# EAGLE design teensy_ms (EAGLE 9.6.2)
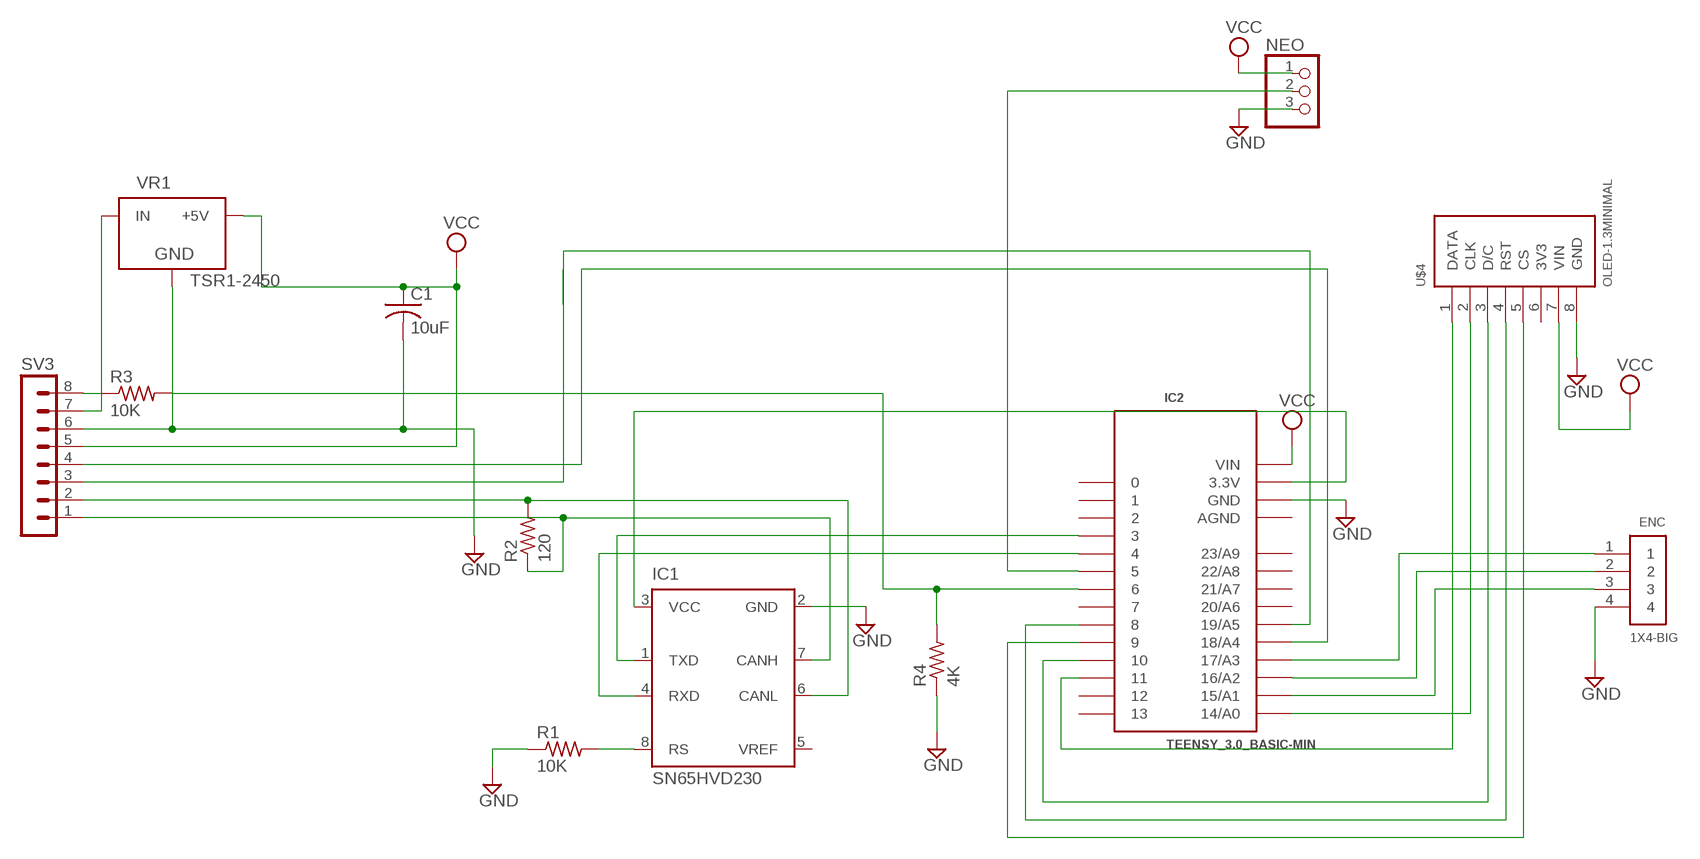
[diagram p0: schematic, sheet 1]

## Parts
C1  10uF  C-USC1206  [C1206]
ENC  1X4-BIG  [1X04-BIG]
IC1  SN65HVD230  [SO8]
IC2  TEENSY_3.0_BASIC-MIN  [TEESNY_3.0_BASIC-MIN]
NEO  PINHD-1X3  [1X03]
R1  10K  R-US_M1206  [M1206]
R2  120  R-US_M1206  [M1206]
R3  10K  R-US_M1206  [M1206]
R4  4K  R-US_M1206  [M1206]
SV3  MA08-1  [MA08-1]
U$4  OLED-1.3MINIMAL  [OLED-1.3-BARE]
VR1  TSR1-2450  [TSR-1]

## Nets
GND: C1.2 ENC.4 IC1.2(GND) IC2.GND NEO.3 R1.1 R4.1 SV3.6 U$4.8(GND) VR1.2(GND)
N$1: IC1.8(RS) R1.2
N$2: IC1.3(VCC) IC2.3.3V
N$3: SV3.7 VR1.1(IN)
N$8: IC2.11 U$4.1(DATA)
N$9: IC2.14/A0 U$4.2(CLK)
N$10: IC2.10 U$4.3(D/C)
N$11: IC2.8 U$4.4(RST)
N$12: IC2.9 U$4.5(CS)
N$13: IC1.4(RXD) IC2.4
N$14: IC2.19/A5 SV3.3
N$15: IC1.1(TXD) IC2.3
N$16: IC2.18/A4 SV3.4
N$17: IC2.5 NEO.2
N$18: IC1.7(CANH) R2.1 SV3.1
N$19: IC2.6 R3.2 R4.2
N$20: IC1.6(CANL) R2.2 SV3.2
N$21: ENC.3 IC2.15/A1
N$22: ENC.2 IC2.16/A2
N$23: ENC.1 IC2.17/A3
N$24: R3.1 SV3.8
VCC: C1.1 IC2.VIN NEO.1 SV3.5 U$4.7(VIN) VR1.3(+5V)
Unconnected: IC1.5(VREF) IC2.0 IC2.1 IC2.2 IC2.7 IC2.12 IC2.13 IC2.20/A6 IC2.21/A7 IC2.22/A8 IC2.23/A9 U$4.6(3V3)

## Power pins joined to a net without a drawn wire
AGND: IC2.AGND

## Library data of the parts
C1 = rcl:C-US: CAPACITOR, American symbol
ENC = adafruit:1X4: 4-pin connector
IC1 = open-bldc:SN65HVD230: SN65HVD230 - 3.3V CAN Transceiver - 3.3V operation - ISO 11898 compliant - up to 1Mbps - up to 120 nodes - listen only mode - slope control
IC2 = Teensy3.0-custom:TEENSY_3.0_BASIC-MIN
NEO = adafruit:PINHD-1X3: PIN HEADER
R1-R4 = adafruit:R-US_: RESISTOR, American symbol
SV3 = con-lstb:MA08-1: PIN HEADER; OC_FARNELL: unknown; OC_NEWARK: unknown
U$4 = custom:OLED-1.3
VR1 = SteelCaveRobotics-Power:TSR1-2450: Traco Power TSR 1-2450 5.0v switching regulator

## Board
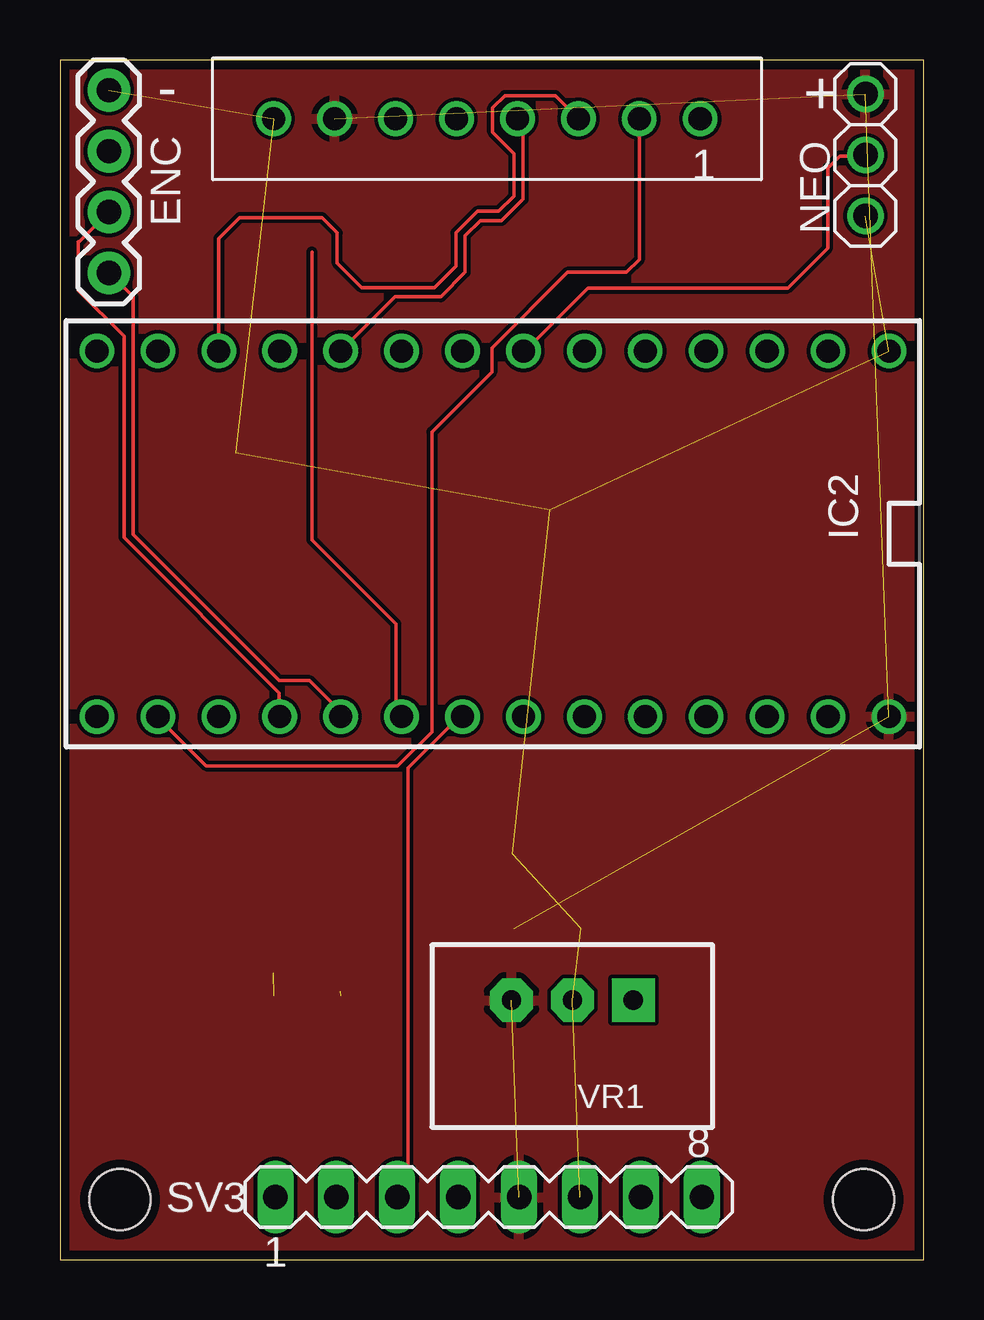
[diagram p1: board, top side]
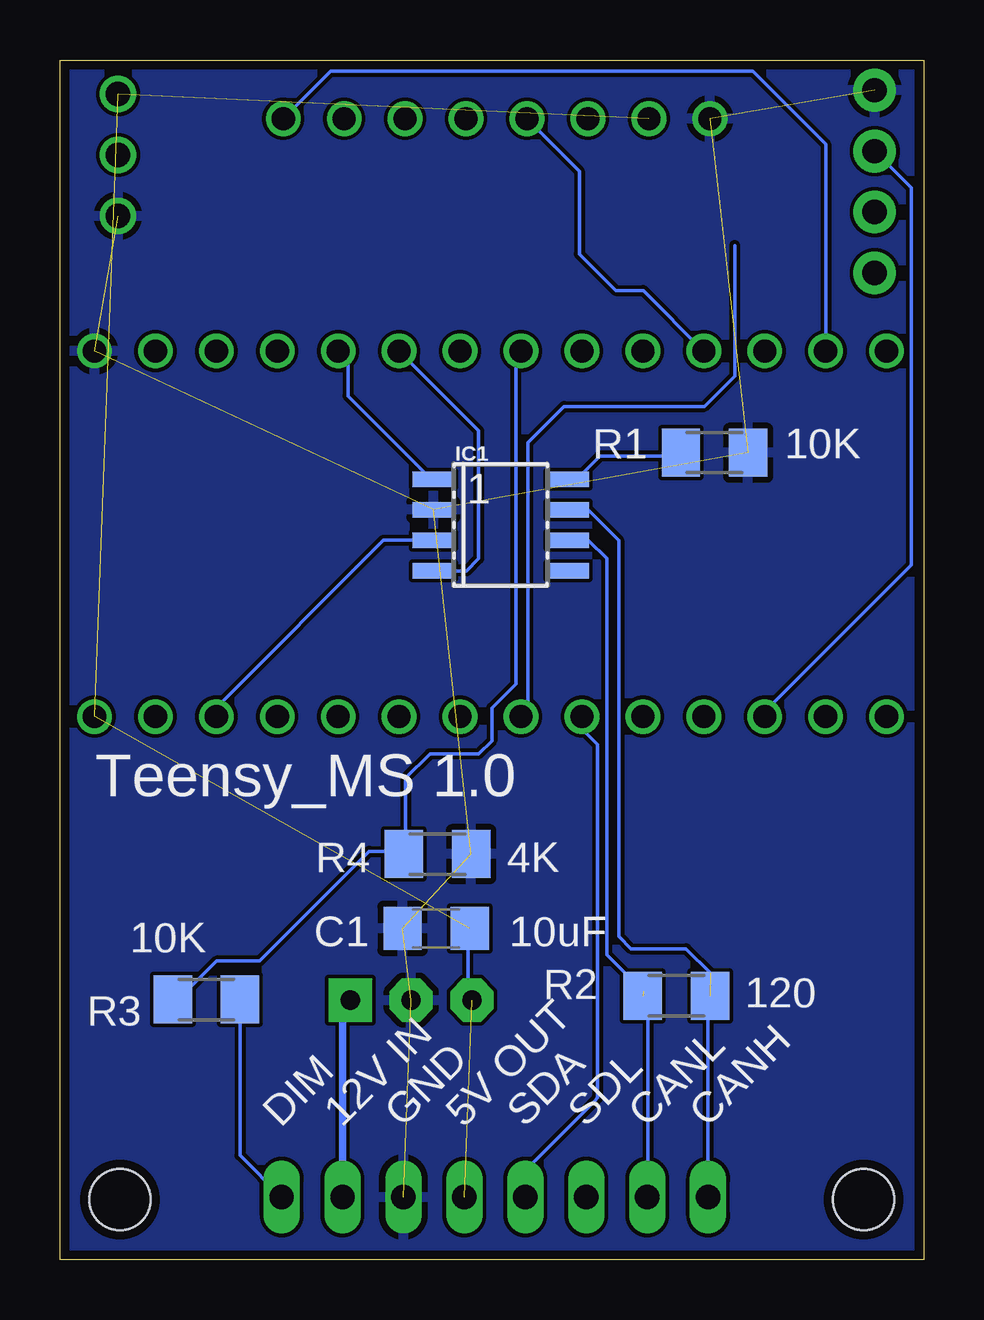
[diagram p2: board, bottom side, seen from below]

Size 36 x 50 mm. Coordinates in mm from the lower left corner, seen from the top.
Outline: 0,0 36,0 36,50 0,50 0,0
Copper layers (1*16): Top 0.0356mm / dielectric 1.5011mm / Bottom 0.0356mm
Design rules "oshpark-2layer": minimum track width 6mil, minimum drill 13mil, track to track 6mil, track to pad 6mil, pad to pad 6mil, via to via 6mil, smd to smd 6mil, copper to edge 15mil, drill to drill 6mil, minimum pad ring 7mil, minimum via ring 7mil, stop-mask expansion 4mil, vias tented up to drill 0mil, thermal gap 10mil
Holes 2.54 mm at 2.5,2.5 33.5,2.5

### Footprints (pad centres in the part's own frame; a part is rotated, then mirrored left to right if it is on the bottom)
C1206 = smd 1.6 x 1.8: 1 -1.4,0; 2 1.4,0
1X04-BIG = drill 1.016 pad 1.778: 1 0,0; 2 2.54,0; 3 5.08,0; 4 7.62,0
SO8 = smd 0.65 x 1.75: 1 -1.905,-2.8; 2 -0.635,-2.8; 3 0.635,-2.8; 4 1.905,-2.8; 5 1.905,2.8; 6 0.635,2.8; 7 -0.635,2.8; 8 -1.905,2.8
TEESNY_3.0_BASIC-MIN = drill 0.965: 0 -7.62,15.24; 1 -7.62,12.7; 2 -7.62,10.16; 3 -7.62,7.62; 3.3V 7.62,12.7; 4 -7.62,5.08; 5 -7.62,2.54; 6 -7.62,0; 7 -7.62,-2.54; 8 -7.62,-5.08; 9 -7.62,-7.62; 10 -7.62,-10.16; 11 -7.62,-12.7; 12 -7.62,-15.24; 13 7.62,-15.24; 14/A0 7.62,-12.7; 15/A1 7.62,-10.16; 16/A2 7.62,-7.62; 17/A3 7.62,-5.08; 18/A4 7.62,-2.54; 19/A5 7.62,0; 20/A6 7.62,2.54; 21/A7 7.62,5.08; 22/A8 7.62,7.62; 23/A9 7.62,10.16; AGND 7.62,15.24; GND -7.62,17.78; VIN 7.62,17.78
1X03 = drill 1.016: 1 -2.54,0; 2 0,0; 3 2.54,0
M1206 = smd 1.6 x 2: 1 -1.4,0; 2 1.4,0
MA08-1 = drill 1.016 long: 1 -8.89,0; 2 -6.35,0; 3 -3.81,0; 4 -1.27,0; 5 1.27,0; 6 3.81,0; 7 6.35,0; 8 8.89,0
OLED-1.3-BARE = drill 0.965: 1 -8.89,0; 2 -6.35,0; 3 -3.81,0; 4 -1.27,0; 5 1.27,0; 6 3.81,0; 7 6.35,0; 8 8.89,0
TSR-1 = drill 0.8 pad 1.8 square: 1 -2.54,-1.5 | drill 0.8 pad 1.8 octagon: 2 0,-1.5; 3 2.54,-1.5

### Placement (x,y rotation side)
C1  20.32,13.8 180 bottom
ENC  2.04,41.12 90 top
IC1  17.63,30.62 270 bottom
IC2  16.78,30.25 270 top
NEO  33.58,46.04 270 top
R1  8.71,33.63 180 bottom
R2  10.3,11 180 bottom
R3  29.89,10.84 180 bottom
R4  20.26,16.9 180 bottom
SV3  17.87,2.6 0 top
U$4  17.8,47.55 180 top
VR1  21.36,9.31 180 top

### Tracks (layer width: path | path; a pad name or v marks a point on that pad's centre or on a via)
GND  (9 unrouted)
  pour Bottom: 0,50 36,50 36,0 0,0
N$1
  Bottom 0.152: IC1.8 14.5,32.5 13.5,33.5 10.5,33.5 R1.2
N$2
  Bottom 0.152: 20.5,30 IC1.3 22.52,29.98 29.5,23 IC2.3.3V
N$3
  Bottom 0.305: SV3.7 24.22,10.49 VR1.1
N$8
  Bottom 0.152: U$4.1 24.71,49.53 7.11,49.53 4.08,46.5 IC2.11
N$9
  Top 0.152: U$4.2 24.15,41.68 23.62,41.15 21.15,41.15 18,38 18,37 15.5,34.5 15.5,22 14.07,20.57 6.1,20.57 4.08,22.59 IC2.14/A0
N$10
  Top 0.152: U$4.3 20.65,48.51 18.54,48.51 18.03,48.01 18.03,46.99 18.92,46.1 18.92,44.32 18.29,43.69 17.4,43.69 16.51,42.8 16.51,41.4 15.62,40.51 12.57,40.51 11.56,41.53 11.56,42.8 10.92,43.43 7.49,43.43 6.62,42.56 IC2.10
N$11
  Top 0.152: U$4.4 19.3,47.32 19.3,44.2 18.41,43.31 17.53,43.31 16.89,42.67 16.89,41.15 15.88,40.13 13.97,40.13 IC2.8
N$12
  Bottom 0.152: U$4.5 14.35,45.37 14.35,41.91 12.83,40.39 11.68,40.39 IC2.9
N$13
  Bottom 0.152: IC2.4 18.54,34.54 18.54,29.21 19.05,28.7 20.42,28.7 IC1.4
N$14
  Top 0.152: IC2.19/A5 16.5,22.5 14.5,20.5 14.5,3 SV3.3
  Bottom 0.152: IC2.19/A5 16.5,23 16.5,34.05 14.99,35.56 9.14,35.56 7.87,36.83 7.87,42.26
N$15
  Bottom 0.152: IC1.1 20.5,32.5 24,36 24,37.5 IC2.3
N$16
  Top 0.152: 10.5,42 10.5,30 14,26.5 14,23 IC2.18/A4
  Bottom 0.152: SV3.4 16.51,2.69 16.51,3.81 13.84,6.48 13.72,6.6 13.59,6.73 13.59,21.46 14.24,22.11 IC2.18/A4
N$17
  Top 0.152: IC2.5 19.5,38 22,40.5 30.34,40.5 32,42.16 32,45.5 32.5,46 33.5,46 NEO.2
N$18  (1 unrouted)
  Bottom 0.152: SV3.1 9,3 9,10.9 R2.1 | IC1.7 13.98,31.25 12.7,29.97 12.7,13.46 12.19,12.95 9.91,12.95 8.89,11.94
N$19
  Bottom 0.152: IC2.6 17,37.5 17,24 18,23 18,21.62 18.54,21.08 20.57,21.08 21.59,20.07 21.59,16.97 R4.2 21.78,17.02 23.11,17.02 27.69,12.45 29.46,12.45 31.29,10.62 R3.2
N$20  (1 unrouted)
  Bottom 0.152: 14.5,30 IC1.6 14.82,29.97 13.97,29.97 13.21,29.21 13.21,12.7 11.68,11.18 | SV3.2 11.5,3 11.5,10.8 R2.2
N$21
  Bottom 0.152: ENC.3 0.51,44.67 0.51,28.96 6.62,22.84 IC2.15/A1
N$22
  Top 0.152: IC2.16/A2 9.14,22.65 9.14,23.62 2.67,30.1 2.67,38.48 0.76,40.39 0.76,42.42 0.8,42.42 ENC.2
N$23
  Top 0.152: IC2.17/A3 11.7,22.84 10.41,24.13 9.14,24.13 3.05,30.23 3.05,40.13 2.06,41.12 ENC.1
N$24
  Bottom 0.152: R3.1 28.49,4.34 SV3.8
VCC  (4 unrouted)
  Bottom 0.152: C1.1 19,14.5 19,11 VR1.3
  pour Top: 0,50 36,50 36,0 0,0

### Text on the board
tNames: - | +
bNames: 1 | Teensy_MS 1.0 | CANH | CANL | SDL | SDA | 5V OUT | GND | 12V IN | DIM